# EAGLE design ME433_2018 (EAGLE 8.7.1)
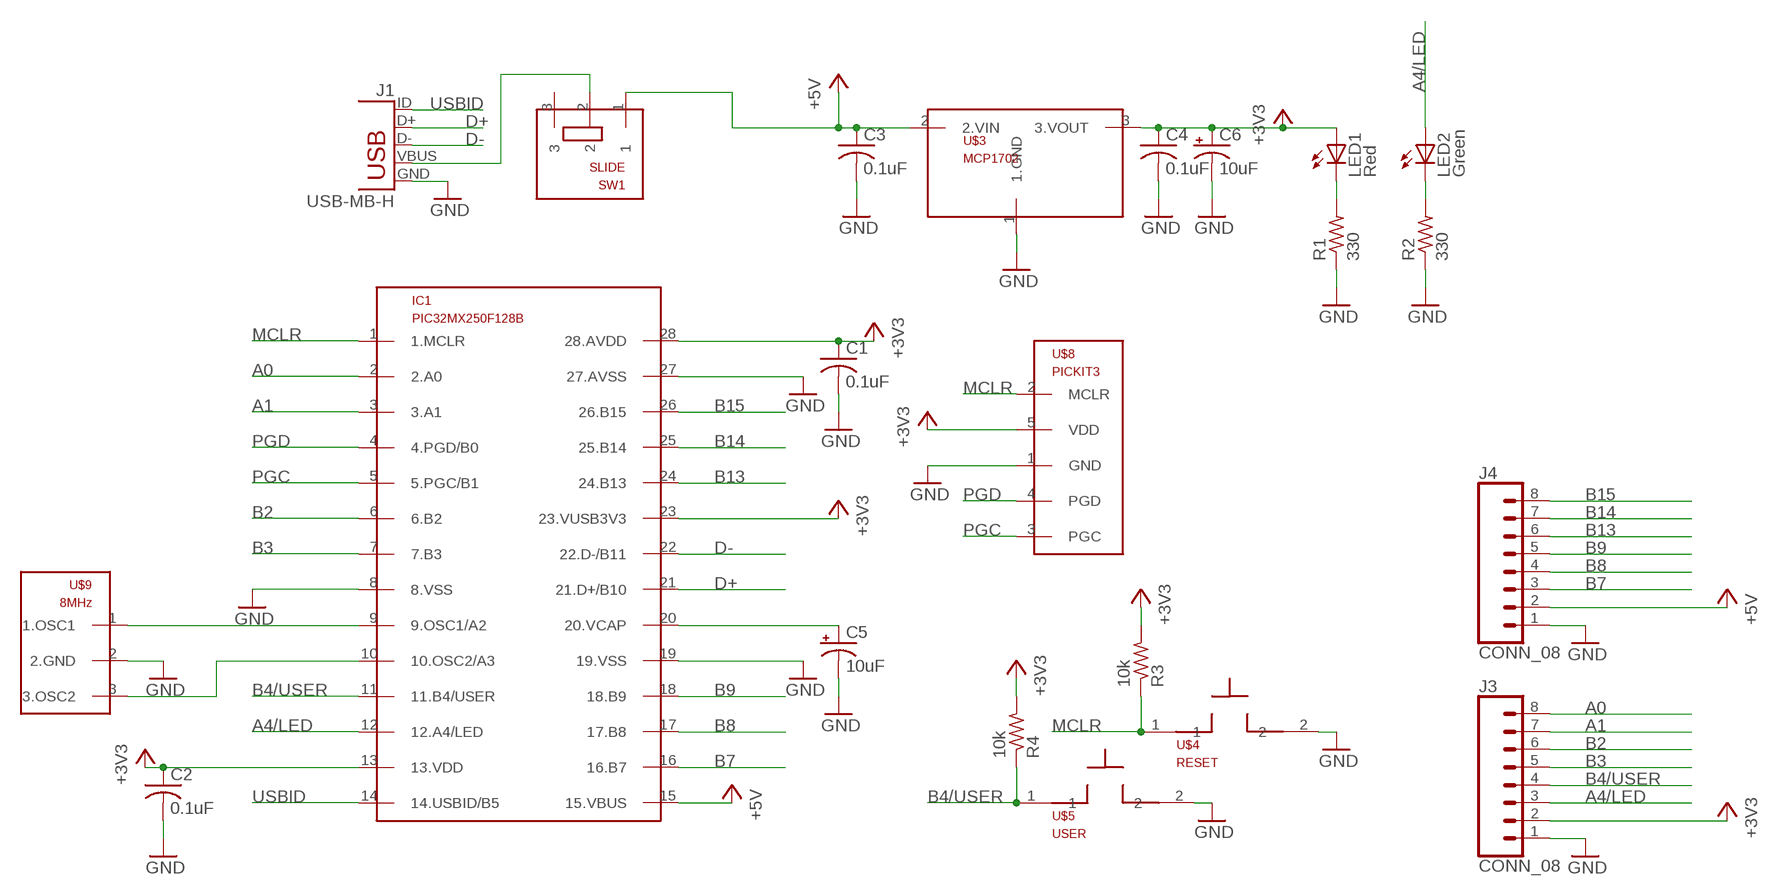
[diagram p0: schematic, sheet 1]

## Parts
C1  0.1uF  C-US025-025X050  [C025-025X050]
C2  0.1uF  C-US025-025X050  [C025-025X050]
C3  0.1uF  C-US025-025X050  [C025-025X050]
C4  0.1uF  C-US025-025X050  [C025-025X050]
C5  10uF  CPOL-USB45181B  [B45181B]
C6  10uF  CPOL-USB45181B  [B45181B]
IC1  PIC32MX250F128B  [DIL28-3]
J1  USB-MB-H  [USB-MB-H]
J3  CONN_08  [1X08]
J4  CONN_08  [1X08]
LED1  Red  LED3MM  [LED3MM]
LED2  Green  LED3MM  [LED3MM]
R1  330  R-US_0207/10  [0207/10]
R2  330  R-US_0207/10  [0207/10]
R3  10k  R-US_0207/10  [0207/10]
R4  10k  R-US_0207/10  [0207/10]
SW1  SLIDE  [SLIDE]
U$3  MCP1702  [TO92]
U$4  RESET  PB  [PB]
U$5  USER  PB  [PB]
U$8  PICKIT3  [1X05]
U$9  8MHz  OSC  [OSC]

## Nets
+3V3: C1.1 C2.1 C4.1 C6.+ IC1.13(13.VDD) IC1.23(23.VUSB3V3) IC1.28(28.AVDD) J3.2 LED1.A R3.2 R4.2 U$3.3(3.VOUT) U$8.5(VDD)
+5V: C3.1 IC1.15(15.VBUS) J4.2 SW1.1 U$3.2(2.VIN)
A0: IC1.2(2.A0) J3.8
A1: IC1.3(3.A1) J3.7
A4/LED: IC1.12(12.A4/LED) J3.3 LED2.A
B2: IC1.6(6.B2) J3.6
B3: IC1.7(7.B3) J3.5
B4/USER: IC1.11(11.B4/USER) J3.4 R4.1 U$5.1
B7: IC1.16(16.B7) J4.3
B8: IC1.17(17.B8) J4.4
B9: IC1.18(18.B9) J4.5
B13: IC1.24(24.B13) J4.6
B14: IC1.25(25.B14) J4.7
B15: IC1.26(26.B15) J4.8
D+: IC1.21(21.D+/B10) J1.D+
D-: IC1.22(22.D-/B11) J1.D-
GND: C1.2 C2.2 C3.2 C4.2 C5.- C6.- IC1.8(8.VSS) IC1.19(19.VSS) IC1.27(27.AVSS) J1.GND J3.1 J4.1 R1.1 R2.1 U$3.1(1.GND) U$4.2 U$5.2 U$8.1(GND) U$9.2(2.GND)
MCLR: IC1.1(1.MCLR) R3.1 U$4.1 U$8.2(MCLR)
N$1: J1.VBUS SW1.2
N$2: LED2.K(C) R2.2
N$4: LED1.K(C) R1.2
N$5: IC1.9(9.OSC1/A2) U$9.1(1.OSC1)
N$6: IC1.10(10.OSC2/A3) U$9.3(3.OSC2)
N$7: C5.+ IC1.20(20.VCAP)
PGC: IC1.5(5.PGC/B1) U$8.3(PGC)
PGD: IC1.4(4.PGD/B0) U$8.4(PGD)
USBID: IC1.14(14.USBID/B5) J1.ID
Unconnected: SW1.3

## Library data of the parts
C1-C4 = ME433_2018:C-US: CAPACITOR, American symbol
C5 C6 = ME433_2018:CPOL-US: POLARIZED CAPACITOR, American symbol
IC1 = ME433_2018:PIC32MX250F128B
J1 = ME433_2018:USB: USB Connectors USB-B-PTH is fully proven SKU : PRT-00139/CONN-08278 USB-miniB is fully proven SKU : PRT-00587 USB-A-PCB is untested. USB-A-H is throughly reviewed, but untested. Spark Fun Electronics SKU : PRT-00437 USB-B-SMT is throughly reviewed, but untested. Needs silkscreen touching up. USB-A-S has not been used/tested USB-MB-H has not been used/tested USB-MICROB has been used. CONN-09505
J3 J4 = ME433_2018:CONN_08
LED1 LED2 = led:LED: LED OSRAM: - CHIPLED LG R971, LG N971, LY N971, LG Q971, LY Q971, LO R971, LY R971 LH N974, LH R974 LS Q976, LO Q976, LY Q976 LO Q996 - Hyper CHIPLED LW Q18S LB Q993, LB Q99A, LB R99A - SideLED LS A670, LO A670, LY A670, LG A670, LP A670 LB A673, LV A673, LT A673, LW A673 LH A674 LY A675 LS A676, LA A676, LO A676, LY A676, LW A676 LS A679, LY A679, LG A679 - Hyper Micro SIDELED® LS Y876, LA Y876, LO Y876, LY Y876 LT Y87S - SmartLED LW L88C, LW L88S LB L89C, LB L89S, LG L890 LS L89K, LO L89K, LY L89K LS L896, LA L896, LO L896, LY L896 - TOPLED LS T670, LO T670, LY T670, LG T670, LP T670 LSG T670, LSP T670, LSY T670, LOP T670, LYG T670 LG T671, LOG T671, LSG T671 LB T673, LV T673, LT T673, LW T673 LH T674 LS T676, LA T676, LO T676, LY T676, LB T676, LH T676, LSB T676, LW T676 LB T67C, LV T67C, LT T67C, LS T67K, LO T67K, LY T67K, LW E67C LS E67B, LA E67B, LO E67B, LY E67B, LB E67C, LV E67C, LT E67C LW T67C LS T679, LY T679, LG T679 LS T770, LO T770, LY T770, LG T770, LP T770 LB T773, LV T773, LT T773, LW T773 LH T774 LS E675, LA E675, LY E675, LS T675 LS T776, LA T776, LO T776, LY T776, LB T776 LHGB T686 LT T68C, LB T68C - Hyper Mini TOPLED® LB M676 - Mini TOPLED Santana® LG M470 LS M47K, LO M47K, LY M47K Source: http://www.osram.convergy.de LUXEON: - LUMILED® LXK2-PW12-R00, LXK2-PW12-S00, LXK2-PW14-U00, LXK2-PW14-V00 LXK2-PM12-R00, LXK2-PM12-S00, LXK2-PM14-U00 LXK2-PE12-Q00, LXK2-PE12-R00, LXK2-PE12-S00, LXK2-PE14-T00, LXK2-PE14-U00 LXK2-PB12-K00, LXK2-PB12-L00, LXK2-PB12-M00, LXK2-PB14-N00, LXK2-PB14-P00, LXK2-PB14-Q00 LXK2-PR12-L00, LXK2-PR12-M00, LXK2-PR14-Q00, LXK2-PR14-R00 LXK2-PD12-Q00, LXK2-PD12-R00, LXK2-PD12-S00 LXK2-PH12-R00, LXK2-PH12-S00 LXK2-PL12-P00, LXK2-PL12-Q00, LXK2-PL12-R00 Source: www.luxeon.com KINGBRIGHT: KA-3528ASYC Source: www.kingbright.com
R1-R4 = ME433_2018:R-US_: RESISTOR, American symbol
SW1 = ME433_2018:SLIDE
U$3 = ME433_2018:MCP1702
U$4 U$5 = ME433_2018:PB
U$8 = ME433_2018:PICKIT3
U$9 = ME433_2018:OSC

## Board
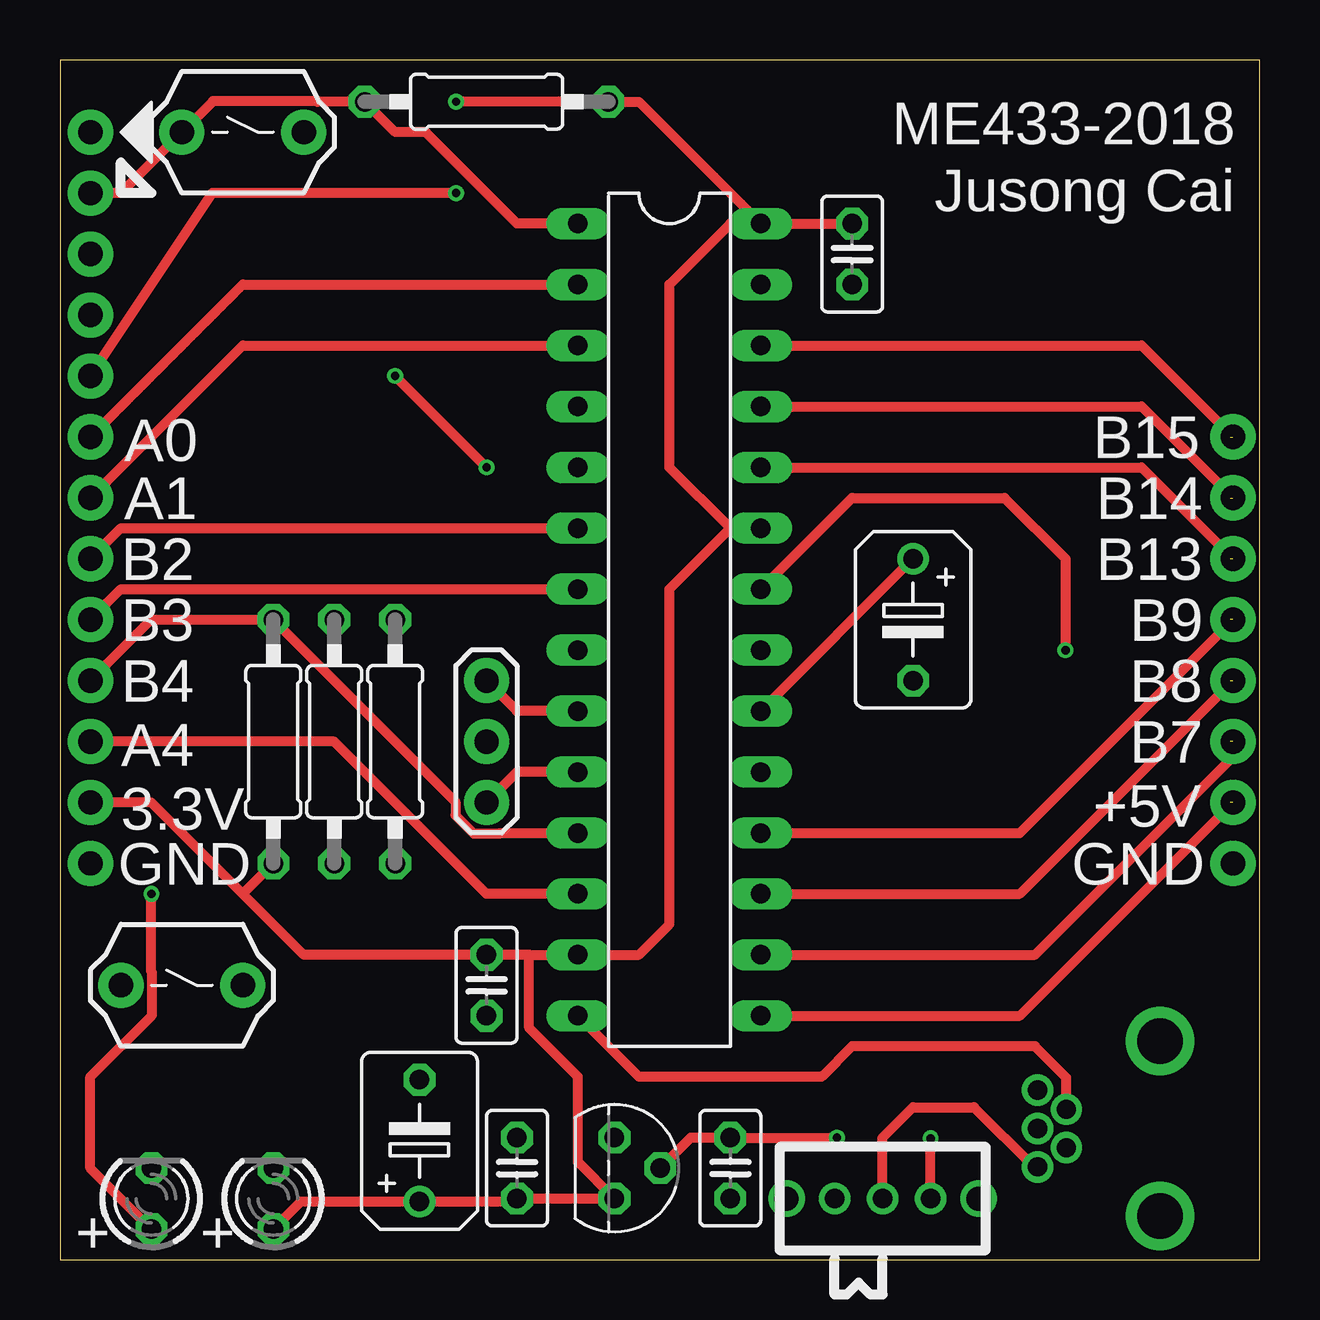
[diagram p1: board, top side]
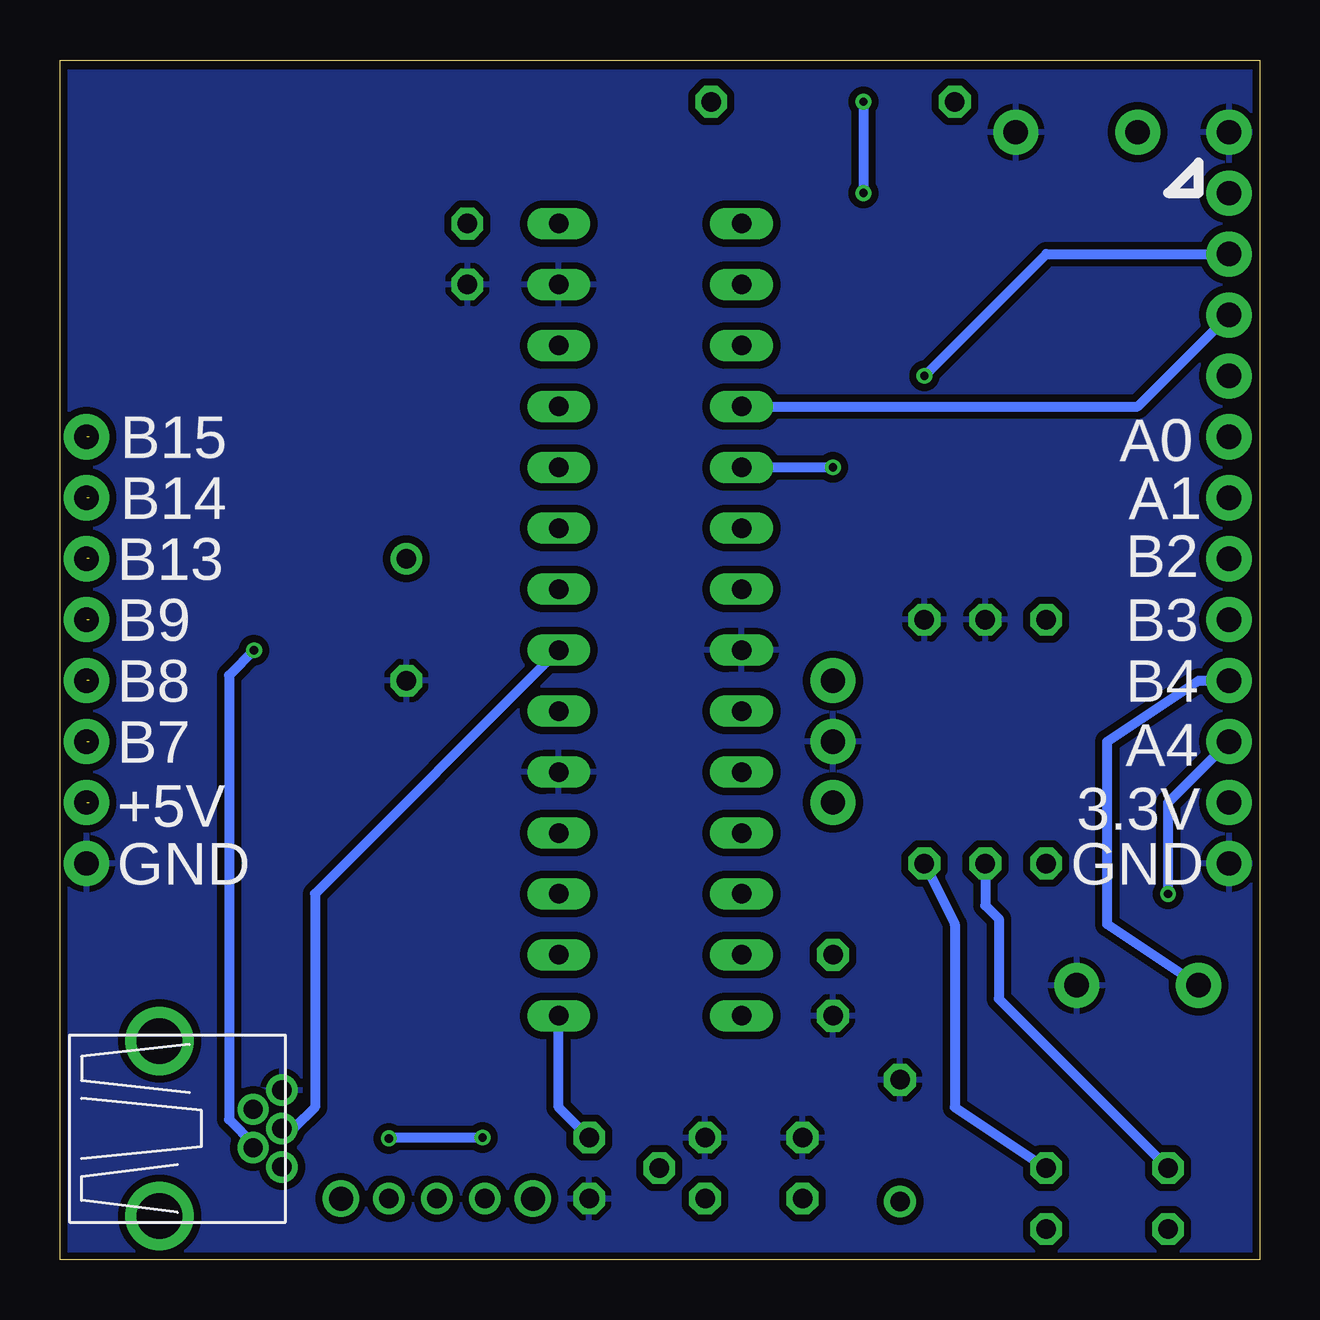
[diagram p2: board, bottom side, seen from below]

Size 50 x 50 mm. Coordinates in mm from the lower left corner, seen from the top.
Outline: 0,0 50,0 50,50 0,50 0,0
Copper layers (1*16): Top 0.035mm / dielectric 1.5mm / Bottom 0.035mm
Design rules "SeeedStudio_2layer_DRU_no_angle_20140221": minimum track width 6mil, minimum drill 12mil, track to track 6mil, track to pad 6mil, pad to pad 6mil, via to via 6mil, smd to smd 0mil, copper to edge 10mil, drill to drill 10mil, minimum pad ring 10mil, minimum via ring 6mil, stop-mask expansion 2mil, vias tented up to drill 100mil, thermal gap 10mil

### Footprints (pad centres in the part's own frame; a part is rotated, then mirrored left to right if it is on the bottom)
C025-025X050 = drill 0.813 octagon: 1 -1.27,0; 2 1.27,0
B45181B = drill 0.813: + -2.54,0 | drill 0.813 octagon: - 2.54,0
DIL28-3 = drill 0.813 long: 1 -16.51,-3.81; 2 -13.97,-3.81; 3 -11.43,-3.81; 4 -8.89,-3.81; 5 -6.35,-3.81; 6 -3.81,-3.81; 7 -1.27,-3.81; 8 1.27,-3.81; 9 3.81,-3.81; 10 6.35,-3.81; 11 8.89,-3.81; 12 11.43,-3.81; 13 13.97,-3.81; 14 16.51,-3.81; 15 16.51,3.81; 16 13.97,3.81; 17 11.43,3.81; 18 8.89,3.81; 19 6.35,3.81; 20 3.81,3.81; 21 1.27,3.81; 22 -1.27,3.81; 23 -3.81,3.81; 24 -6.35,3.81; 25 -8.89,3.81; 26 -11.43,3.81; 27 -13.97,3.81; 28 -16.51,3.81
USB-MB-H = drill 0.8: D+ 5.1,0; D- 3.9,0.8; GND 5.1,-1.6; ID 3.9,-0.8; VBUS 5.1,1.6 | drill 1.9: P$6 0,-3.65; P$7 0,3.65
1X08 = drill 1.016 pad 1.88: 1 0,0; 2 2.54,0; 3 5.08,0; 4 7.62,0; 5 10.16,0; 6 12.7,0; 7 15.24,0; 8 17.78,0
LED3MM = drill 0.813 octagon: A -1.27,0; K 1.27,0
0207/10 = drill 0.813 octagon: 1 -5.08,0; 2 5.08,0
SLIDE = drill 0.8: 1 -2,0; 2 0,0; 3 2,0 | drill 1: P$1 -4,0; P$2 4,0
TO92 = drill 0.813 octagon: 1 -1.27,0; 2 0,1.905; 3 1.27,0
PB = drill 1.016 pad 1.88: 1 -2.54,0; 2 2.54,0
1X05 = drill 1.016 pad 1.88: 1 0,0; 2 2.54,0; 3 5.08,0; 4 7.62,0; 5 10.16,0
OSC = drill 1.016 pad 1.88: 1 -2.54,0; 2 0,0; 3 2.54,0

### Placement (x,y rotation side)
C1  33.02,41.91 270 top
C2  17.78,11.43 270 top
C3  27.94,3.81 270 top
C4  19.05,3.81 90 top
C5  35.56,26.67 270 top
C6  14.99,4.95 90 top
IC1  25.4,26.67 270 top
J1  45.85,5.46 180 top
J3  1.27,16.51 90 top
J4  48.9,16.51 90 top
LED1  8.89,2.54 90 top
LED2  3.81,2.54 90 top
R1  13.97,21.59 270 top
R2  11.43,21.59 270 top
R3  17.78,48.26 0 top
R4  8.89,21.59 270 top
SW1  34.29,2.54 180 top
U$3  23.11,3.81 270 top
U$4  7.62,46.99 0 top
U$5  5.08,11.43 0 top
U$8  1.27,46.99 270 top
U$9  17.78,21.59 270 top

### Tracks (layer width: path | path; a pad name or v marks a point on that pad's centre or on a via)
+3V3  (via drill 0.35)
  Top 0.406: LED1.A 10.03,2.41 C6.+ 18.92,2.41 C4.1 U$3.3 21.59,4.06 21.59,7.62 19.56,9.65 19.56,12.7 | 19.56,12.7 IC1.13 24.13,12.7 25.4,13.97 25.4,27.94 27.94,30.48 | 19.56,12.7 C2.1 10.16,12.7 7.62,15.24 | IC1.23 27.94,30.48 | 27.94,30.48 25.4,33.02 25.4,40.64 27.94,43.18 IC1.28 | IC1.28 C1.1 | IC1.28 24.13,48.26 R3.2 v16.51,48.26 | U$8.5 6.35,44.45 v16.51,44.45 | 7.62,15.24 3.81,19.05 J3.2 | R4.2 7.62,15.24
  Bottom 0.406: v16.51,48.26 v16.51,44.45
+5V  (via drill 0.35)  (1 unrouted)
  Top 0.406: U$3.2 26.29,5.08 C3.1 v32.38,5.08 | IC1.15 40.01,10.16 48.78,18.94 48.78,19.05 | SW1.1 v36.29,5.05
  Bottom 0.406: C3.1 29.21,6.35 IC1.15 | v32.38,5.08 36.32,5.08 v36.29,5.05
A0
  Top 0.406: J3.8 7.62,40.64 IC1.2
A1
  Top 0.406: J3.7 7.62,38.1 IC1.3
A4/LED  (via drill 0.35)
  Top 0.406: LED2.A 1.27,3.81 1.27,7.62 3.83,10.19 3.83,11.97 3.81,11.99 v3.81,15.24 | IC1.12 17.78,15.24 11.43,21.59 J3.3
  Bottom 0.406: v3.81,15.24 3.81,19.05 J3.3
B2
  Top 0.406: J3.6 2.54,30.48 IC1.6
B3
  Top 0.406: J3.5 2.54,27.94 IC1.7
B4/USER
  Top 0.406: J3.4 3.81,26.67 R4.1 16.48,19.07 16.48,18.51 17.24,17.75 18.32,17.75 18.34,17.78 IC1.11
  Bottom 0.406: U$5.1 6.35,13.97 6.35,21.59 2.54,24.13 J3.4
B7  (1 unrouted)
  Top 0.406: IC1.16 40.64,12.7 48.78,20.84 48.78,21.59
B8  (1 unrouted)
  Top 0.406: IC1.17 40.01,15.24 48.78,24.02 48.78,24.13
B9  (1 unrouted)
  Top 0.406: IC1.18 40.01,17.78 48.78,26.56 48.78,26.67
B13  (1 unrouted)
  Top 0.406: 48.78,29.21 48.78,29.32 45.09,33.02 IC1.24
B14  (1 unrouted)
  Top 0.406: 48.78,31.75 48.78,31.86 45.09,35.56 IC1.25
B15  (1 unrouted)
  Top 0.406: 48.78,34.29 48.78,34.4 45.09,38.1 IC1.26
D+
  Bottom 0.406: IC1.21 39.37,15.24 39.37,6.35 40.26,5.46 J1.D+
D-  (via drill 0.35)
  Top 0.406: IC1.22 33.02,31.75 39.37,31.75 41.91,29.21 v41.91,25.4
  Bottom 0.406: J1.D- 41.95,4.83 42.96,5.84 42.96,24.35 v41.91,25.4
GND
  pour Bottom (isolate 0.305): 0,49.53 49.91,49.53 50.04,49.4 50.04,0 0,0
MCLR
  Top 0.406: U$8.2 2.54,44.45 U$4.1 6.38,48.28 10.7,48.28 10.72,48.26 R3.1 13.97,46.99 15.24,46.99 19.05,43.18 IC1.1
N$1
  Top 0.406: SW1.2 34.29,5.08 35.56,6.35 38.1,6.35 40.59,3.86 J1.VBUS
N$2
  Bottom 0.406: R2.2 11.43,14.76 10.87,14.2 10.87,10.87 LED2.K
N$4
  Bottom 0.406: R1.2 12.7,13.97 12.7,6.35 LED1.K
N$5
  Top 0.406: IC1.9 19.05,22.86 U$9.1
N$6
  Top 0.406: IC1.10 19.05,20.32 U$9.3
N$7
  Top 0.406: IC1.20 C5.+
PGC  (via drill 0.35)
  Top 0.406: v13.97,36.83 v17.78,33.02
  Bottom 0.406: U$8.3 8.89,41.91 v13.97,36.83 | v17.78,33.02 IC1.5
PGD
  Bottom 0.406: IC1.4 5.08,35.56 U$8.4
USBID
  Top 0.406: J1.ID 41.95,7.58 40.64,8.89 33.02,8.89 31.75,7.62 24.13,7.62 IC1.14

### Text on the board
tPlace: ME433-2018 | Jusong Cai | A0 | B15 | A1 | B14 | B2 | B13 | B3 | B9 | B4 | B8 | A4 | B7 | 3.3V | +5V | GND | GND | + | +
bPlace: A0 | B15 | A1 | B14 | B2 | B13 | B3 | B9 | B4 | B8 | A4 | B7 | 3.3V | +5V | GND | GND